# EAGLE design GOLpHAT_rev1 (EAGLE 6.4)
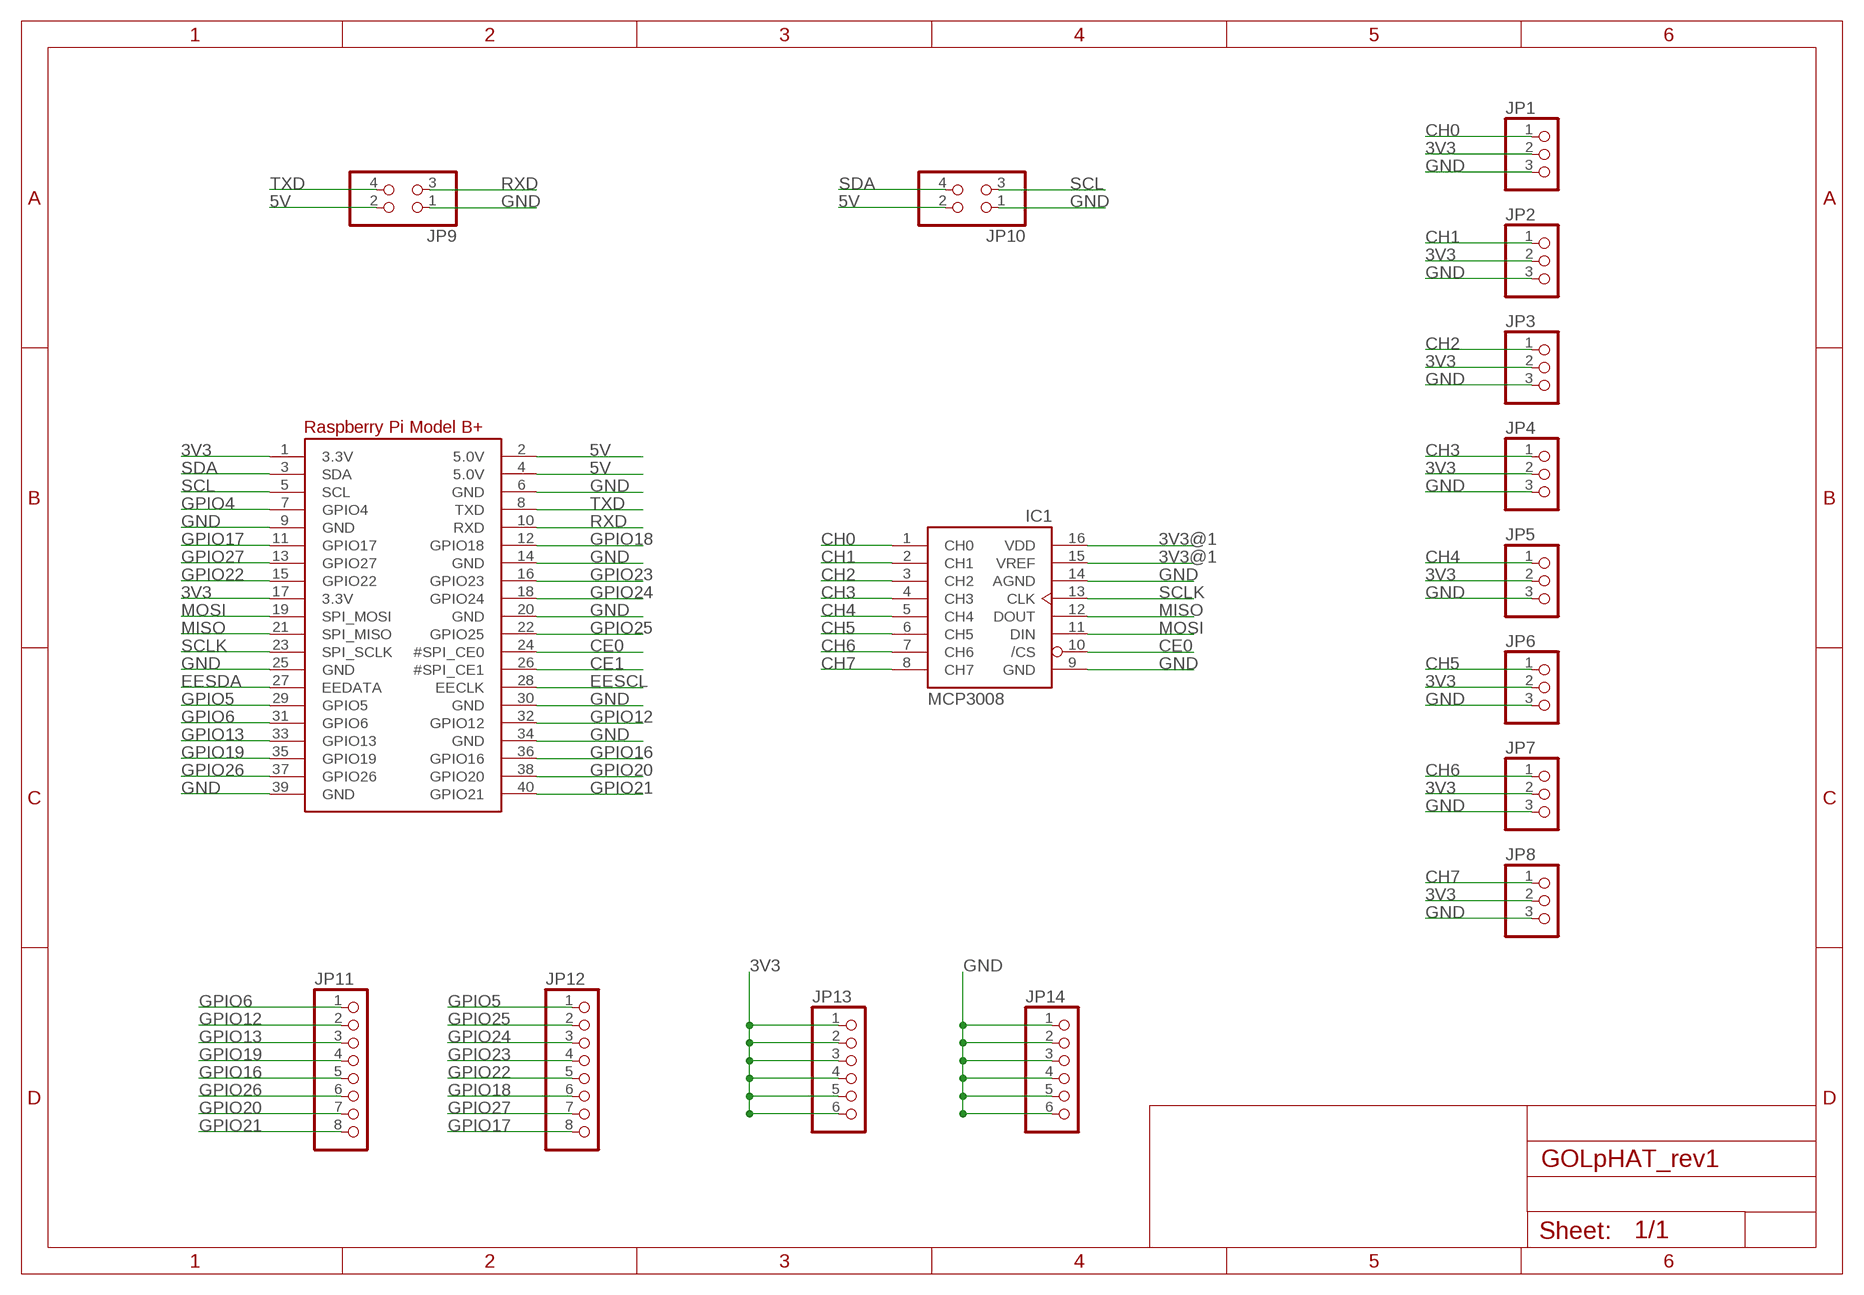
[diagram p0: schematic, sheet 1]

## Parts
IC1  MCP3008  [DIL16]
JP1  PINHD-1X3  [1X03]
JP2  PINHD-1X3  [1X03]
JP3  PINHD-1X3  [1X03]
JP4  PINHD-1X3  [1X03]
JP5  PINHD-1X3  [1X03]
JP6  PINHD-1X3  [1X03]
JP7  PINHD-1X3  [1X03]
JP8  PINHD-1X3  [1X03]
JP9  PINHD-2X2  [2X02]
JP10  PINHD-2X2  [2X02]
JP11  PINHD-1X8CLEANBIG  [1X08-CLEANBIG]
JP12  PINHD-1X8CLEANBIG  [1X08-CLEANBIG]
JP13  PINHD-1X6CB  [1X06-CLEANBIG]
JP14  PINHD-1X6CB  [1X06-CLEANBIG]
RPI1  RASPBERRYPI_BPLUS_PHAT  [PI_BONNET]

## Nets
3V3: JP1.2 JP2.2 JP3.2 JP4.2 JP5.2 JP6.2 JP7.2 JP8.2 JP13.1 JP13.2 JP13.3 JP13.4 JP13.5 JP13.6 RPI1.1(3.3V) RPI1.17(3.3V)
3V3@1: IC1.15(VREF) IC1.16(VDD)
5V: JP9.2 JP10.2 RPI1.2(5.0V) RPI1.4(5.0V)
CE0: IC1.10(/CS) RPI1.24(#SPI_CE0)
CE1: RPI1.26(#SPI_CE1)
CH0: IC1.1(CH0) JP1.1
CH1: IC1.2(CH1) JP2.1
CH2: IC1.3(CH2) JP3.1
CH3: IC1.4(CH3) JP4.1
CH4: IC1.5(CH4) JP5.1
CH5: IC1.6(CH5) JP6.1
CH6: IC1.7(CH6) JP7.1
CH7: IC1.8(CH7) JP8.1
EESCL: RPI1.28(EECLK)
EESDA: RPI1.27(EEDATA)
GND: IC1.9(GND) IC1.14(AGND) JP1.3 JP2.3 JP3.3 JP4.3 JP5.3 JP6.3 JP7.3 JP8.3 JP9.1 JP10.1 JP14.1 JP14.2 JP14.3 JP14.4 JP14.5 JP14.6 RPI1.6(GND) RPI1.9(GND) RPI1.14(GND) RPI1.20(GND) RPI1.25(GND) RPI1.30(GND) RPI1.34(GND) RPI1.39(GND)
GPIO4: RPI1.7(GPIO4)
GPIO5: JP12.1 RPI1.29(GPIO5)
GPIO6: JP11.1 RPI1.31(GPIO6)
GPIO12: JP11.2 RPI1.32(GPIO12)
GPIO13: JP11.3 RPI1.33(GPIO13)
GPIO16: JP11.5 RPI1.36(GPIO16)
GPIO17: JP12.8 RPI1.11(GPIO17)
GPIO18: JP12.6 RPI1.12(GPIO18)
GPIO19: JP11.4 RPI1.35(GPIO19)
GPIO20: JP11.7 RPI1.38(GPIO20)
GPIO21: JP11.8 RPI1.40(GPIO21)
GPIO22: JP12.5 RPI1.15(GPIO22)
GPIO23: JP12.4 RPI1.16(GPIO23)
GPIO24: JP12.3 RPI1.18(GPIO24)
GPIO25: JP12.2 RPI1.22(GPIO25)
GPIO26: JP11.6 RPI1.37(GPIO26)
GPIO27: JP12.7 RPI1.13(GPIO27)
MISO: IC1.12(DOUT) RPI1.21(SPI_MISO)
MOSI: IC1.11(DIN) RPI1.19(SPI_MOSI)
RXD: JP9.3 RPI1.10(RXD)
SCL: JP10.3 RPI1.5(SCL)
SCLK: IC1.13(CLK) RPI1.23(SPI_SCLK)
SDA: JP10.4 RPI1.3(SDA)
TXD: JP9.4 RPI1.8(TXD)

## Library data of the parts
IC1 = adafruit:MCP3008
JP1-JP8 = pinhead:PINHD-1X3: PIN HEADER
JP9 JP10 = pinhead:PINHD-2X2: PIN HEADER
JP11 JP12 = adafruit:PINHD-1X8: PIN HEADER
JP13 JP14 = adafruit:PINHD-1X6: PIN HEADER
RPI1 = microbuilder:RASPBERRYPI_BPLUS

## Board
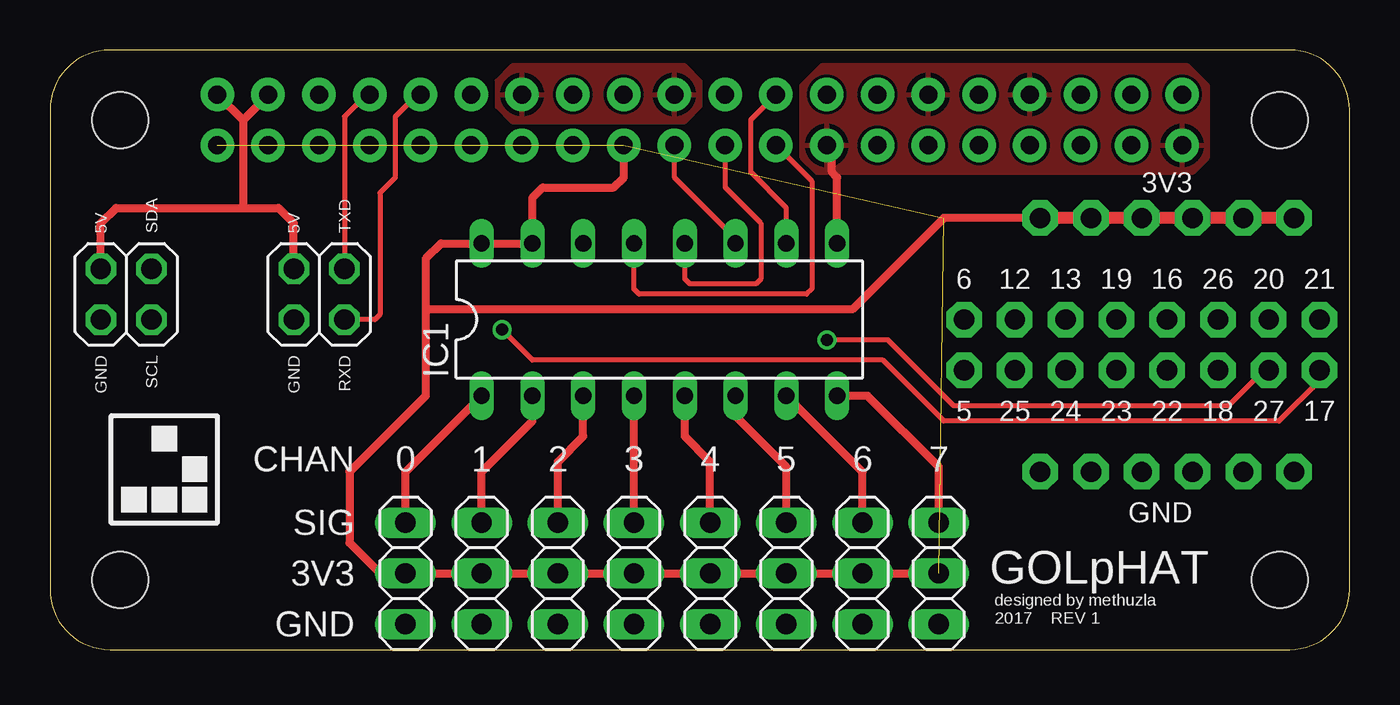
[diagram p1: board, top side]
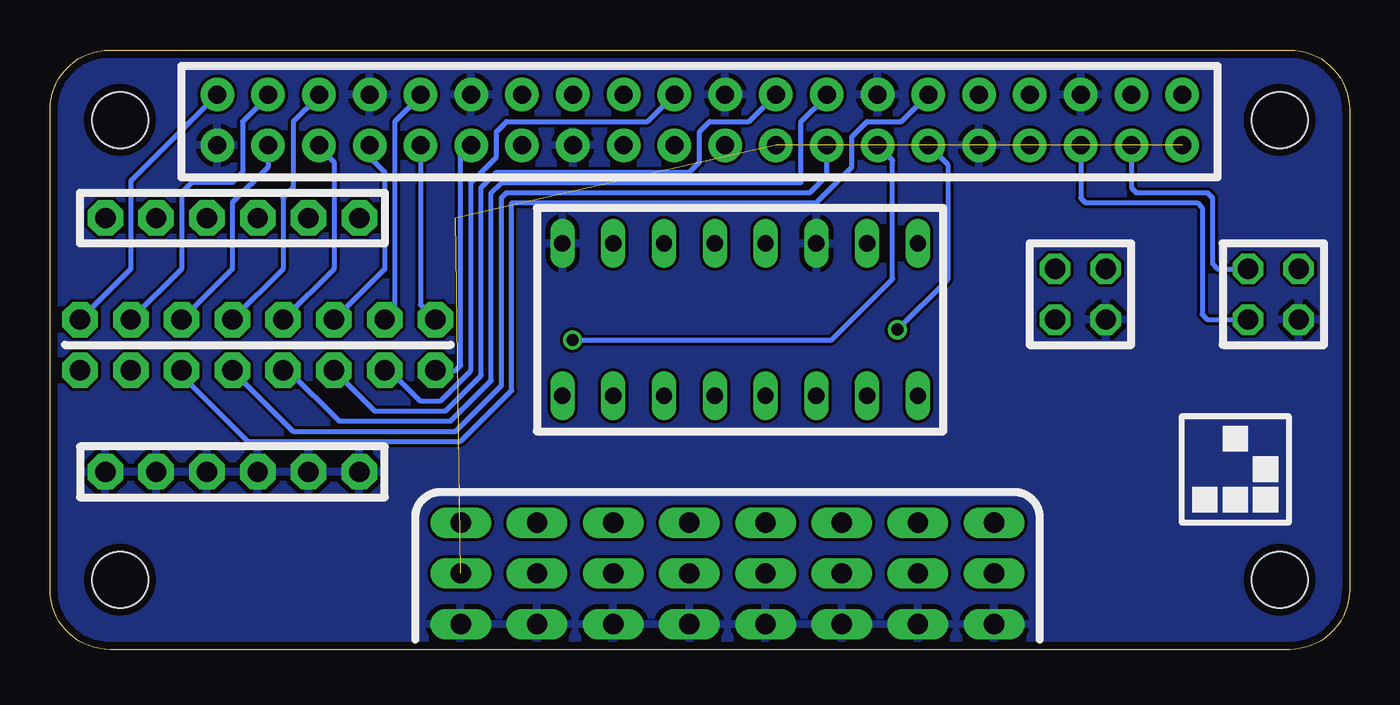
[diagram p2: board, bottom side, seen from below]

Size 65 x 30 mm. Coordinates in mm from the lower left corner, seen from the top.
Copper layers (1*16): Top 0.0356mm / dielectric 1.5011mm / Bottom 0.0356mm
Design rules "LaenPCBOrder": minimum track width 6mil, minimum drill 13mil, track to track 6mil, track to pad 6mil, pad to pad 6mil, via to via 6mil, smd to smd 6mil, copper to edge 15mil, drill to drill 6mil, minimum pad ring 7mil, minimum via ring 7mil, stop-mask expansion 4mil, vias tented up to drill 0mil, thermal gap 10mil

### Footprints (pad centres in the part's own frame; a part is rotated, then mirrored left to right if it is on the bottom)
DIL16 = drill 0.813 long: 1 -8.89,-3.81; 2 -6.35,-3.81; 3 -3.81,-3.81; 4 -1.27,-3.81; 5 1.27,-3.81; 6 3.81,-3.81; 7 6.35,-3.81; 8 8.89,-3.81; 9 8.89,3.81; 10 6.35,3.81; 11 3.81,3.81; 12 1.27,3.81; 13 -1.27,3.81; 14 -3.81,3.81; 15 -6.35,3.81; 16 -8.89,3.81
1X03 = drill 1.016 long: 1 -2.54,0; 2 0,0; 3 2.54,0
2X02 = drill 1.016 octagon: 1 -1.27,-1.27; 2 -1.27,1.27; 3 1.27,-1.27; 4 1.27,1.27
1X08-CLEANBIG = drill 1.016 pad 1.778 octagon: 1 -8.89,0; 2 -6.35,0; 3 -3.81,0; 4 -1.27,0; 5 1.27,0; 6 3.81,0; 7 6.35,0; 8 8.89,0
1X06-CLEANBIG = drill 1.016 pad 1.778 octagon: 1 -6.35,0; 2 -3.81,0; 3 -1.27,0; 4 1.27,0; 5 3.81,0; 6 6.35,0
PI_BONNET = drill 0.9 pad 1.676: 1 8.37,25.23; 2 8.37,27.77; 3 10.91,25.23; 4 10.91,27.77; 5 13.45,25.23; 6 13.45,27.77; 7 15.99,25.23; 8 15.99,27.77; 9 18.53,25.23; 10 18.53,27.77; 11 21.07,25.23; 12 21.07,27.77; 13 23.61,25.23; 14 23.61,27.77; 15 26.15,25.23; 16 26.15,27.77; 17 28.69,25.23; 18 28.69,27.77; 19 31.23,25.23; 20 31.23,27.77; 21 33.77,25.23; 22 33.77,27.77; 23 36.31,25.23; 24 36.31,27.77; 25 38.85,25.23; 26 38.85,27.77; 27 41.39,25.23; 28 41.39,27.77; 29 43.93,25.23; 30 43.93,27.77; 31 46.47,25.23; 32 46.47,27.77; 33 49.01,25.23; 34 49.01,27.77; 35 51.55,25.23; 36 51.55,27.77; 37 54.09,25.23; 38 54.09,27.77; 39 56.63,25.23; 40 56.63,27.77 | hole 2.8: 3.5,3.5; 3.5,26.5; 61.5,26.5; 61.5,3.5

### Placement (x,y rotation side)
IC1  30.48,16.51 0 top
JP1  17.78,3.81 270 top
JP2  21.59,3.81 270 top
JP3  25.4,3.81 270 top
JP4  29.21,3.81 270 top
JP5  33.02,3.81 270 top
JP6  36.83,3.81 270 top
JP7  40.64,3.81 270 top
JP8  44.45,3.81 270 top
JP9  13.46,17.78 0 top
JP10  3.81,17.78 0 top
JP11  54.61,16.51 0 top
JP12  54.61,13.97 0 top
JP13  55.88,21.59 0 top
JP14  55.88,8.89 0 top
RPI1  0,0 0 top

### Tracks (layer width: path | path; a pad name or v marks a point on that pad's centre or on a via)
3V3  (3 unrouted)
  Top 0.406: JP1.2 JP2.2 JP3.2 JP4.2 JP5.2 JP6.2 JP7.2 JP8.2 | JP13.1 44.7,21.59
  Top 0.61: JP13.6 JP13.5 JP13.4 JP13.3 JP13.2 JP13.1
3V3@1
  Top 0.406: 18.8,17.02 18.8,19.56 19.56,20.32 IC1.16 IC1.15 24.13,22.61 24.64,23.11 28.19,23.11 28.7,23.62 28.7,25.22 | 18.8,17.02 18.8,12.7 14.99,8.89 14.99,5.33 16.51,3.81 | 44.7,21.59 40.13,17.02 18.8,17.02
5V
  Top 0.406: RPI1.2 9.65,26.49 | JP10.2 2.54,21.34 3.3,22.1 9.65,22.1 | 9.65,22.1 11.43,22.1 12.19,21.34 JP9.2 | RPI1.4 10.91,27.75 9.65,26.49 | 9.65,26.49 9.65,22.1
CE0
  Top 0.254: IC1.10 36.83,22.1 35.05,23.88 35.05,26.51 RPI1.24
CH0
  Top 0.406: JP1.1 17.78,8.89 IC1.1
CH1
  Top 0.406: JP2.1 21.59,8.89 24.13,11.43 IC1.2
CH2
  Top 0.406: JP3.1 25.4,9.4 26.67,10.67 IC1.3
CH3
  Top 0.406: JP4.1 IC1.4
CH4
  Top 0.406: JP5.1 33.02,9.4 31.75,10.67 IC1.5
CH5
  Top 0.406: JP6.1 36.83,9.14 34.29,11.68 IC1.6
CH6
  Top 0.406: JP7.1 40.64,8.89 IC1.7
CH7
  Top 0.406: JP8.1 44.45,9.14 40.89,12.7 IC1.8
GND
  Top 0.406: IC1.9 39.37,23.62 39.12,23.88 39.12,24.96 RPI1.25
  pour Bottom: 0,0 0,30.48 64.77,30.48 66.04,30.48 66.04,0
  pour Top: 37.59,26.42 37.59,24.64 38.35,23.88 57.15,23.88 57.91,24.64 57.91,28.19 56.9,29.21 38.61,29.21 37.59,28.19
  pour Top: 23.11,29.21 22.35,28.45 22.35,27.69 22.35,27.18 23.11,26.42 31.75,26.42 32.51,27.18 32.51,28.45 31.75,29.21
GPIO5
  Bottom 0.254: JP12.1 44.7,13.97 44.45,14.22 44.45,24.71 RPI1.29
GPIO6
  Bottom 0.254: RPI1.31 46.47,17.26 JP11.1
GPIO12
  Bottom 0.254: RPI1.32 46.47,27.7 47.75,26.42 47.75,17.02 JP11.2
GPIO13
  Bottom 0.254: RPI1.33 49.01,24.63 48.26,23.88 48.26,19.05 JP11.3
GPIO16
  Bottom 0.254: RPI1.36 51.55,27.7 52.83,26.42 52.83,23.11 53.34,22.61 53.34,19.05 JP11.5
GPIO17  (via drill 0.6)
  Top 0.254: JP12.8 63.5,13.46 61.47,11.43 44.7,11.43 41.66,14.48 24.13,14.48 v22.61,16
  Bottom 0.254: v22.61,16 20.07,18.54 20.07,24.23 RPI1.11
GPIO18
  Bottom 0.254: JP12.6 58.42,13.72 55.12,10.41 44.45,10.41 41.91,12.95 41.91,22.35 26.67,22.35 24.89,24.13 24.89,25.65 24.13,26.42 22.42,26.42 RPI1.12
GPIO19
  Bottom 0.254: RPI1.35 51.55,25.13 50.8,24.38 50.8,19.05 JP11.4
GPIO20
  Bottom 0.254: RPI1.38 54.09,27.7 55.37,26.42 55.37,23.88 55.88,23.37 57.91,23.37 58.42,22.86 58.42,19.05 JP11.7
GPIO21
  Bottom 0.254: RPI1.40 60.96,23.44 60.96,19.05 JP11.8
GPIO22
  Bottom 0.254: JP12.5 52.83,10.92 44.7,10.92 42.42,13.21 42.42,22.61 42.16,22.86 27,22.86 26.15,23.71 RPI1.15
GPIO23
  Bottom 0.254: JP12.4 53.09,13.97 50.55,11.43 44.96,11.43 42.93,13.46 42.93,22.86 42.42,23.37 27.43,23.37 27.43,26.42 26.15,27.7 RPI1.16
GPIO24
  Bottom 0.254: JP12.3 48.77,11.94 45.21,11.94 43.43,13.72 43.43,23.11 42.67,23.88 33.02,23.88 32.51,24.38 32.51,25.91 32,26.42 30.04,26.42 RPI1.18
GPIO25
  Bottom 0.254: JP12.2 48.01,13.97 46.48,12.45 45.47,12.45 43.94,13.97 43.94,23.37 42.67,24.64 42.67,25.91 42.16,26.42 35.12,26.42 RPI1.22
GPIO26
  Bottom 0.254: RPI1.37 54.09,24.14 55.88,22.35 55.88,19.05 JP11.6
GPIO27  (via drill 0.6)
  Top 0.254: JP12.7 60.71,13.97 58.93,12.19 45.21,12.19 41.91,15.49 v38.86,15.49
  Bottom 0.254: v38.86,15.49 25.91,15.49 22.86,18.54 22.86,24.48 RPI1.13
MISO
  Top 0.254: RPI1.21 33.78,25.22 33.78,23.11 35.56,21.34 35.56,18.54 35.31,18.29 32,18.29 31.75,18.54 IC1.12
MOSI
  Top 0.254: IC1.11 34.29,20.57 31.24,23.62 31.24,25.22 RPI1.19
RXD
  Top 0.254: RPI1.10 18.37,27.77 17.27,26.67 17.27,23.62 16.51,22.86 16.51,16.76 16.26,16.51 JP9.3
SCL
  Bottom 0.254: RPI1.5 13.45,22.59 13.21,22.35 7.62,22.35 7.37,22.1 7.37,16.76 7.11,16.51 JP10.3
SCLK
  Top 0.254: RPI1.23 38.1,23.44 38.1,18.03 37.85,17.78 29.46,17.78 29.21,18.03 IC1.13
SDA
  Bottom 0.254: RPI1.3 10.91,23.1 10.67,22.86 7.11,22.86 6.86,22.61 6.86,19.3 6.6,19.05 JP10.4
TXD
  Top 0.254: RPI1.8 15.83,27.77 14.73,26.67 JP9.4

### Text on the board
tPlace: 3V3 | 5V | SDA | 5V | TXD | 6 | 12 | 13 | 19 | 16 | 26 | 20 | 21 | GND | SCL | GND | RXD | 5 | 25 | 24 | 23 | 22 | 18 | 27 | 17 | CHAN | 0 | 1 | 2 | 3 | 4 | 5 | 6 | 7 | GND | SIG | 3V3 | GOLpHAT | GND | designed by methuzla / 2017 REV 1